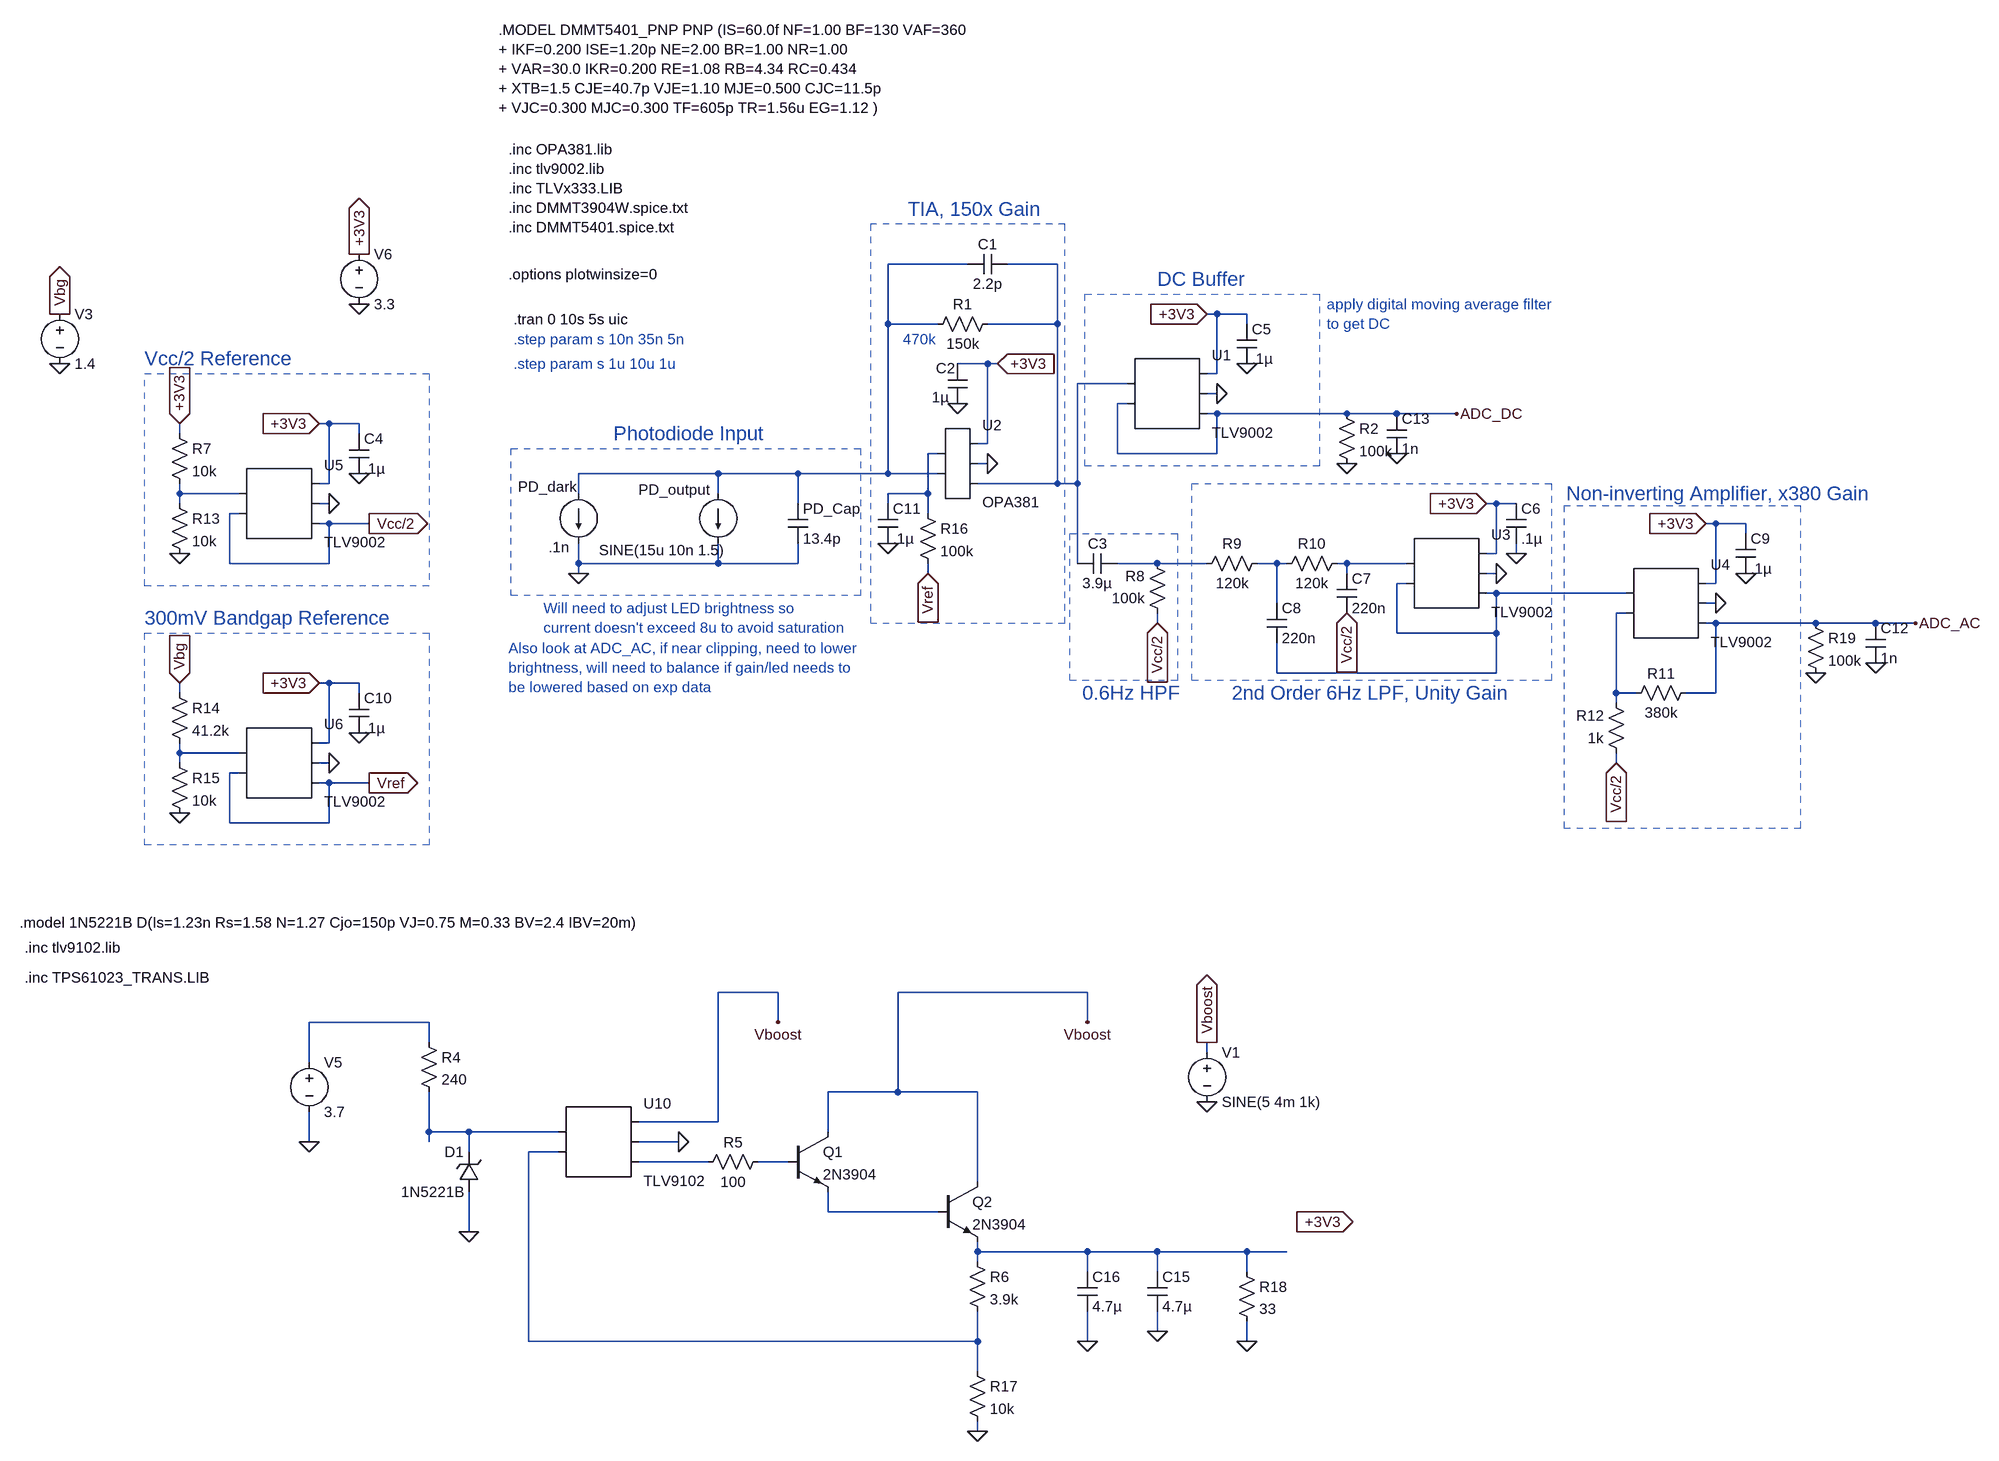
[diagram p0: schematic Capstone_AFE.asc]
Capstone_AFE.asc, the LTspice schematic file:
Version 4
SHEET 1 2868 2336
WIRE 1200 -160 1072 -160
WIRE 1344 -160 1264 -160
WIRE 1600 -80 1584 -80
WIRE 1648 -80 1600 -80
WIRE 1072 -64 1072 -160
WIRE 1152 -64 1072 -64
WIRE 1344 -64 1344 -160
WIRE 1344 -64 1232 -64
WIRE 1648 -64 1648 -80
WIRE 1232 0 1184 0
WIRE 1248 0 1232 0
WIRE 1600 16 1600 -80
WIRE 1600 16 1584 16
WIRE 1456 32 1376 32
WIRE 1600 48 1584 48
WIRE 1456 64 1440 64
WIRE 1600 80 1584 80
WIRE 1808 80 1600 80
WIRE 1888 80 1808 80
WIRE 1984 80 1888 80
WIRE 176 96 160 96
WIRE 224 96 176 96
WIRE -64 112 -64 96
WIRE 224 112 224 96
WIRE 1232 128 1232 0
WIRE 1232 128 1216 128
WIRE 1152 144 1136 144
WIRE 1440 144 1440 64
WIRE 1600 144 1600 80
WIRE 1600 144 1440 144
WIRE 1232 160 1216 160
WIRE 800 176 576 176
WIRE 928 176 800 176
WIRE 1072 176 1072 -64
WIRE 1072 176 928 176
WIRE 1152 176 1072 176
WIRE 176 192 176 96
WIRE 176 192 160 192
WIRE 1344 192 1344 -64
WIRE 1344 192 1216 192
WIRE 1376 192 1376 32
WIRE 1376 192 1344 192
WIRE -64 208 -64 192
WIRE 32 208 -64 208
WIRE 576 208 576 176
WIRE 800 208 800 176
WIRE 1136 208 1136 144
WIRE 1136 208 1072 208
WIRE -64 224 -64 208
WIRE 176 224 160 224
WIRE 928 224 928 176
WIRE 1072 224 1072 208
WIRE 2048 224 2032 224
WIRE 2080 224 2048 224
WIRE 32 240 16 240
WIRE 1136 240 1136 208
WIRE 176 256 160 256
WIRE 240 256 176 256
WIRE 2400 256 2384 256
WIRE 2448 256 2400 256
WIRE 2448 272 2448 256
WIRE 2048 304 2048 224
WIRE 2048 304 2032 304
WIRE 2080 304 2080 288
WIRE 16 320 16 240
WIRE 176 320 176 256
WIRE 176 320 16 320
WIRE 576 320 576 288
WIRE 800 320 800 288
WIRE 800 320 576 320
WIRE 928 320 928 288
WIRE 928 320 800 320
WIRE 1376 320 1376 192
WIRE 1504 320 1440 320
WIRE 1584 320 1504 320
WIRE 1696 320 1664 320
WIRE 1712 320 1696 320
WIRE 1808 320 1792 320
WIRE 1904 320 1808 320
WIRE 576 336 576 320
WIRE 1136 336 1136 320
WIRE 1808 336 1808 320
WIRE 2048 336 2032 336
WIRE 1904 352 1888 352
WIRE 2400 352 2400 256
WIRE 2400 352 2384 352
WIRE 2048 368 2032 368
WIRE 2256 368 2048 368
WIRE 1696 384 1696 320
WIRE 2400 384 2384 384
WIRE 2256 400 2240 400
WIRE 1504 416 1504 400
WIRE 2400 416 2384 416
WIRE 2560 416 2400 416
WIRE 2656 416 2560 416
WIRE 2720 416 2656 416
WIRE 1888 432 1888 352
WIRE 2048 432 2048 368
WIRE 2048 432 1888 432
WIRE 1696 496 1696 448
WIRE 2048 496 2048 432
WIRE 2048 496 1696 496
WIRE 176 512 160 512
WIRE 224 512 176 512
WIRE -64 528 -64 512
WIRE 224 528 224 512
WIRE 2240 528 2240 400
WIRE 2272 528 2240 528
WIRE 2400 528 2400 416
WIRE 2400 528 2352 528
WIRE 2240 544 2240 528
WIRE 176 608 176 512
WIRE 176 608 160 608
WIRE -64 624 -64 608
WIRE 32 624 -64 624
WIRE -64 640 -64 624
WIRE 176 640 160 640
WIRE 2240 640 2240 624
WIRE 32 656 16 656
WIRE 176 672 160 672
WIRE 240 672 176 672
WIRE 16 736 16 656
WIRE 176 736 176 672
WIRE 176 736 16 736
WIRE 896 1008 800 1008
WIRE 1392 1008 1088 1008
WIRE 336 1056 144 1056
WIRE 896 1056 896 1008
WIRE 1392 1056 1392 1008
WIRE 336 1088 336 1056
WIRE 1584 1104 1584 1088
WIRE 144 1120 144 1056
WIRE 1088 1168 1088 1008
WIRE 1088 1168 976 1168
WIRE 1216 1168 1088 1168
WIRE 800 1216 800 1008
WIRE 800 1216 672 1216
WIRE 336 1232 336 1168
WIRE 400 1232 336 1232
WIRE 544 1232 400 1232
WIRE 976 1232 976 1168
WIRE 144 1248 144 1200
WIRE 336 1248 336 1232
WIRE 736 1248 672 1248
WIRE 400 1264 400 1232
WIRE 544 1264 496 1264
WIRE 784 1280 672 1280
WIRE 912 1280 864 1280
WIRE 1216 1312 1216 1168
WIRE 976 1360 976 1328
WIRE 1152 1360 976 1360
WIRE 400 1392 400 1328
WIRE 1216 1424 1216 1408
WIRE 1392 1424 1216 1424
WIRE 1504 1424 1392 1424
WIRE 1648 1424 1504 1424
WIRE 1712 1424 1648 1424
WIRE 1216 1440 1216 1424
WIRE 1392 1456 1392 1424
WIRE 1504 1456 1504 1424
WIRE 1648 1456 1648 1424
WIRE 1504 1552 1504 1520
WIRE 496 1568 496 1264
WIRE 1216 1568 1216 1520
WIRE 1216 1568 496 1568
WIRE 1392 1568 1392 1520
WIRE 1648 1568 1648 1536
WIRE 1216 1616 1216 1568
WIRE 1216 1712 1216 1696
FLAG -64 512 Vbg
IOPIN -64 512 In
FLAG 576 336 0
FLAG 1136 336 Vref
IOPIN 1136 336 In
FLAG 1184 64 0
FLAG 1248 0 +3V3
IOPIN 1248 0 In
FLAG 1232 160 0
FLAG 1504 416 Vcc/2
IOPIN 1504 416 In
FLAG 1648 0 0
FLAG 1584 -80 +3V3
IOPIN 1584 -80 In
FLAG 1600 48 0
FLAG 240 256 Vcc/2
IOPIN 240 256 Out
FLAG 1984 80 ADC_DC
FLAG 2080 304 0
FLAG 2032 224 +3V3
IOPIN 2032 224 In
FLAG 2048 336 0
FLAG 1808 400 Vcc/2
IOPIN 1808 400 In
FLAG 2448 336 0
FLAG 2384 256 +3V3
IOPIN 2384 256 In
FLAG 2400 384 0
FLAG 2240 640 Vcc/2
IOPIN 2240 640 In
FLAG 2720 416 ADC_AC
FLAG 224 176 0
FLAG 160 96 +3V3
IOPIN 160 96 In
FLAG 176 224 0
FLAG -64 96 +3V3
IOPIN -64 96 In
FLAG -64 304 0
FLAG 224 592 0
FLAG 160 512 +3V3
IOPIN 160 512 In
FLAG 176 640 0
FLAG -64 720 0
FLAG 240 672 Vref
IOPIN 240 672 Out
FLAG 224 -96 0
FLAG 224 -176 +3V3
IOPIN 224 -176 Out
FLAG 1072 288 0
FLAG -256 0 0
FLAG -256 -80 Vbg
IOPIN -256 -80 Out
FLAG 736 1248 0
FLAG 144 1248 0
FLAG 1216 1712 0
FLAG 1504 1552 0
FLAG 1648 1568 0
FLAG 896 1056 Vboost
FLAG 1392 1056 Vboost
FLAG 400 1392 0
FLAG 1392 1568 0
FLAG 1728 1376 +3V3
IOPIN 1728 1376 Out
FLAG 1584 1184 0
FLAG 1584 1088 Vboost
IOPIN 1584 1088 Out
FLAG 2560 496 0
FLAG 2656 480 0
FLAG 1888 144 0
FLAG 1808 160 0
SYMBOL current 800 208 R0
WINDOW 0 -128 -6 Left 2
WINDOW 3 -191 91 Left 2
SYMATTR InstName PD_output
SYMATTR Value SINE(15u 10n 1.5)
SYMBOL current 576 208 R0
WINDOW 0 -97 -11 Left 2
WINDOW 3 -48 86 Left 2
SYMATTR InstName PD_dark
SYMATTR Value .1n
SYMBOL Cap 912 224 R0
SYMATTR InstName PD_Cap
SYMATTR Value 13.4p
SYMBOL Res 1248 -80 R90
WINDOW 0 0 56 VBottom 2
WINDOW 3 32 56 VTop 2
SYMATTR InstName R1
SYMATTR Value 150k
SYMBOL Cap 1264 -176 R90
WINDOW 0 0 32 VBottom 2
WINDOW 3 32 32 VTop 2
SYMATTR InstName C1
SYMATTR Value 2.2p
SYMBOL Cap 1168 0 R0
WINDOW 0 -19 7 Left 2
WINDOW 3 -25 53 Left 2
SYMATTR InstName C2
SYMATTR Value 1µ
SYMBOL AutoGenerated/OPA381 1184 160 R0
SYMATTR InstName U2
SYMBOL Res 1520 416 R180
WINDOW 0 36 76 Left 2
WINDOW 3 36 40 Left 2
SYMATTR InstName R8
SYMATTR Value 100k
SYMBOL Cap 1440 304 R90
WINDOW 0 0 32 VBottom 2
WINDOW 3 32 32 VTop 2
SYMATTR InstName C3
SYMATTR Value 3.9µ
SYMBOL Cap 1632 -64 R0
SYMATTR InstName C5
SYMATTR Value .1µ
SYMBOL AutoGenerated/TLV9002 1520 48 R0
SYMATTR InstName U1
SYMBOL AutoGenerated/TLV9002 1968 336 R0
SYMATTR InstName U3
SYMBOL Cap 2064 224 R0
SYMATTR InstName C6
SYMATTR Value .1µ
SYMBOL Res 1680 304 R90
WINDOW 0 0 56 VBottom 2
WINDOW 3 32 56 VTop 2
SYMATTR InstName R9
SYMATTR Value 120k
SYMBOL Res 1808 304 R90
WINDOW 0 0 56 VBottom 2
WINDOW 3 32 56 VTop 2
SYMATTR InstName R10
SYMATTR Value 120k
SYMBOL Cap 1792 336 R0
SYMATTR InstName C7
SYMATTR Value 220n
SYMBOL Cap 1680 384 R0
SYMATTR InstName C8
SYMATTR Value 220n
SYMBOL Cap 2432 272 R0
SYMATTR InstName C9
SYMATTR Value .1µ
SYMBOL AutoGenerated/TLV9002 2320 384 R0
SYMATTR InstName U4
SYMBOL Res 2368 512 R90
WINDOW 0 0 56 VBottom 2
WINDOW 3 32 56 VTop 2
SYMATTR InstName R11
SYMATTR Value 380k
SYMBOL Res 2256 640 R180
WINDOW 0 36 76 Left 2
WINDOW 3 36 40 Left 2
SYMATTR InstName R12
SYMATTR Value 1k
SYMBOL Cap 208 112 R0
SYMATTR InstName C4
SYMATTR Value .1µ
SYMBOL AutoGenerated/TLV9002 96 224 R0
SYMATTR InstName U5
SYMBOL Res -80 96 R0
SYMATTR InstName R7
SYMATTR Value 10k
SYMBOL Res -80 208 R0
SYMATTR InstName R13
SYMATTR Value 10k
SYMBOL Cap 208 528 R0
SYMATTR InstName C10
SYMATTR Value .1µ
SYMBOL AutoGenerated/TLV9002 96 640 R0
SYMATTR InstName U6
SYMBOL Res -80 512 R0
SYMATTR InstName R14
SYMATTR Value 41.2k
SYMBOL Res -80 624 R0
SYMATTR InstName R15
SYMATTR Value 10k
SYMBOL Cap 1056 224 R0
SYMATTR InstName C11
SYMATTR Value .1µ
SYMBOL Res 1120 224 R0
SYMATTR InstName R16
SYMATTR Value 100k
SYMBOL Voltage -256 -96 R0
SYMATTR InstName V3
SYMATTR Value 1.4
SYMBOL res 320 1072 R0
SYMATTR InstName R4
SYMATTR Value 240
SYMBOL voltage 144 1104 R0
WINDOW 123 0 0 Left 0
WINDOW 39 0 0 Left 0
SYMATTR InstName V5
SYMATTR Value 3.7
SYMBOL res 880 1264 R90
WINDOW 0 0 56 VBottom 2
WINDOW 3 32 56 VTop 2
SYMATTR InstName R5
SYMATTR Value 100
SYMBOL npn 912 1232 R0
SYMATTR InstName Q1
SYMATTR Value 2N3904
SYMBOL npn 1152 1312 R0
SYMATTR InstName Q2
SYMATTR Value 2N3904
SYMBOL res 1200 1424 R0
SYMATTR InstName R6
SYMATTR Value 3.9k
SYMBOL res 1200 1600 R0
SYMATTR InstName R17
SYMATTR Value 10k
SYMBOL cap 1488 1456 R0
SYMATTR InstName C15
SYMATTR Value 4.7µ
SYMBOL res 1632 1440 R0
SYMATTR InstName R18
SYMATTR Value 33
SYMBOL zener 416 1328 R180
WINDOW 0 24 64 Left 2
WINDOW 3 24 0 Left 2
SYMATTR InstName D1
SYMATTR Value 1N5221B
SYMBOL cap 1376 1456 R0
SYMATTR InstName C16
SYMATTR Value 4.7µ
SYMBOL AutoGenerated/TLV9102 608 1248 R0
SYMATTR InstName U10
SYMBOL Voltage 1584 1088 R0
SYMATTR InstName V1
SYMATTR Value SINE(5 4m 1k)
SYMBOL Voltage 224 -192 R0
SYMATTR InstName V6
SYMATTR Value 3.3
SYMBOL Res 2544 400 R0
SYMATTR InstName R19
SYMATTR Value 100k
SYMBOL Cap 2640 416 R0
SYMATTR InstName C12
SYMATTR Value 1n
SYMBOL Res 1792 64 R0
SYMATTR InstName R2
SYMATTR Value 100k
SYMBOL Cap 1872 80 R0
SYMATTR InstName C13
SYMATTR Value 1n
TEXT 464 -344 Left 2 !.inc OPA381.lib\n.inc tlv9002.lib\n.inc TLVx333.LIB\n.inc DMMT3904W.spice.txt\n.inc DMMT5401.spice.txt
TEXT 472 -72 Left 2 !.tran 0 10s 5s uic
TEXT 464 -144 Left 2 !.options plotwinsize=0
TEXT 520 392 Left 2 ;Will need to adjust LED brightness so \ncurrent doesn't exceed 8u to avoid saturation
TEXT 1776 -96 Left 2 ;apply digital moving average filter \nto get DC
TEXT 1384 528 Left 3 ;0.6Hz HPF
TEXT 1624 528 Left 3 ;2nd Order 6Hz LPF, Unity Gain
TEXT 2160 208 Left 3 ;Non-inverting Amplifier, x380 Gain
TEXT 1104 -248 Left 3 ;TIA, 150x Gain
TEXT 1504 -136 Left 3 ;DC Buffer
TEXT 632 112 Left 3 ;Photodiode Input
TEXT 472 -40 Left 2 ;.step param s 10n 35n 5n
TEXT 464 456 Left 2 ;Also look at ADC_AC, if near clipping, need to lower \nbrightness, will need to balance if gain/led needs to \nbe lowered based on exp data
TEXT 472 0 Left 2 ;.step param s 1u 10u 1u
TEXT -120 -8 Left 3 ;Vcc/2 Reference
TEXT -120 408 Left 3 ;300mV Bandgap Reference
TEXT 1096 -40 Left 2 ;470k
TEXT 448 -536 Left 2 !.MODEL DMMT5401_PNP PNP (IS=60.0f NF=1.00 BF=130 VAF=360 \n+ IKF=0.200 ISE=1.20p NE=2.00 BR=1.00 NR=1.00 \n+ VAR=30.0 IKR=0.200 RE=1.08 RB=4.34 RC=0.434 \n+ XTB=1.5 CJE=40.7p VJE=1.10 MJE=0.500 CJC=11.5p \n+ VJC=0.300 MJC=0.300 TF=605p TR=1.56u EG=1.12 )
TEXT -312 984 Left 2 !.inc TPS61023_TRANS.LIB
TEXT -312 936 Left 2 !.inc tlv9102.lib
TEXT -320 896 Left 2 !.model 1N5221B D(Is=1.23n Rs=1.58 N=1.27 Cjo=150p VJ=0.75 M=0.33 BV=2.4 IBV=20m)
RECTANGLE Normal 1388 -112 1764 164 2
RECTANGLE Normal 1560 192 2136 508 2
RECTANGLE Normal 2536 228 2156 744 2
RECTANGLE Normal 1364 272 1536 508 2
RECTANGLE Normal 468 136 1028 372 2
RECTANGLE Normal -120 16 336 356 2
RECTANGLE Normal -120 432 336 772 2
RECTANGLE Normal 1044 416 1356 -224 2

The netlist it stands for:
* Capstone_AFE.asc
I§PD_output N001 0 SINE(15u 10n 1.5)
I§PD_dark N001 0 .1n
C§PD_Cap N001 0 13.4p
R1 N002 N001 150k
C1 N002 N001 2.2p
C2 +3V3 0 1µ
* U2: OPA381 (symbol AutoGenerated/OPA381 not available, pins judged from their places): pin1=N003 pin2=N001 pin3=+3V3 pin4=0 pin5=N002
R8 Vcc/2 N005 100k
C3 N005 N002 3.9µ
C5 +3V3 0 .1µ
* U1: TLV9002 (symbol AutoGenerated/TLV9002 not available, pins judged from their places): pin1=N002 pin2=ADC_DC pin3=+3V3 pin4=0 pin5=ADC_DC
* U3: TLV9002 (symbol AutoGenerated/TLV9002 not available, pins judged from their places): pin1=N007 pin2=N008 pin3=+3V3 pin4=0 pin5=N008
C6 +3V3 0 .1µ
R9 N006 N005 120k
R10 N007 N006 120k
C7 N007 Vcc/2 220n
C8 N006 N008 220n
C9 +3V3 0 .1µ
* U4: TLV9002 (symbol AutoGenerated/TLV9002 not available, pins judged from their places): pin1=N008 pin2=N009 pin3=+3V3 pin4=0 pin5=ADC_AC
R11 ADC_AC N009 380k
R12 Vcc/2 N009 1k
C4 +3V3 0 .1µ
* U5: TLV9002 (symbol AutoGenerated/TLV9002 not available, pins judged from their places): pin1=N004 pin2=Vcc/2 pin3=+3V3 pin4=0 pin5=Vcc/2
R7 +3V3 N004 10k
R13 N004 0 10k
C10 +3V3 0 .1µ
* U6: TLV9002 (symbol AutoGenerated/TLV9002 not available, pins judged from their places): pin1=N010 pin2=Vref pin3=+3V3 pin4=0 pin5=Vref
R14 Vbg N010 41.2k
R15 N010 0 10k
C11 N003 0 .1µ
R16 N003 Vref 100k
V3 Vbg 0 1.4
R4 N011 N012 240
V5 N011 0 3.7
R5 N015 N014 100
Q1 Vboost N015 N016 0 2N3904
Q2 Vboost N016 N017 0 2N3904
R6 N017 N013 3.9k
R17 N013 0 10k
C15 N017 0 4.7µ
R18 N017 0 33
D1 0 N012 1N5221B
C16 N017 0 4.7µ
* U10: TLV9102 (symbol AutoGenerated/TLV9102 not available, pins judged from their places): pin1=N012 pin2=N013 pin3=Vboost pin4=0 pin5=N014
V1 Vboost 0 SINE(5 4m 1k)
V6 +3V3 0 3.3
R19 ADC_AC 0 100k
C12 ADC_AC 0 1n
R2 ADC_DC 0 100k
C13 ADC_DC 0 1n
.model D D
.lib standard.dio
.model NPN NPN
.model PNP PNP
.lib standard.bjt
.inc OPA381.lib
.inc tlv9002.lib
.inc TLVx333.LIB
.inc DMMT3904W.spice.txt
.inc DMMT5401.spice.txt
.tran 0 10s 5s uic
.options plotwinsize=0
* Will need to adjust LED brightness so
* current doesn't exceed 8u to avoid saturation
* apply digital moving average filter
* to get DC
* 0.6Hz HPF
* 2nd Order 6Hz LPF, Unity Gain
* Non-inverting Amplifier, x380 Gain
* TIA, 150x Gain
* DC Buffer
* Photodiode Input
* .step param s 10n 35n 5n
* Also look at ADC_AC, if near clipping, need to lower
* brightness, will need to balance if gain/led needs to
* be lowered based on exp data
* .step param s 1u 10u 1u
* Vcc/2 Reference
* 300mV Bandgap Reference
* 470k
.MODEL DMMT5401_PNP PNP (IS=60.0f NF=1.00 BF=130 VAF=360
+ IKF=0.200 ISE=1.20p NE=2.00 BR=1.00 NR=1.00
+ VAR=30.0 IKR=0.200 RE=1.08 RB=4.34 RC=0.434
+ XTB=1.5 CJE=40.7p VJE=1.10 MJE=0.500 CJC=11.5p
+ VJC=0.300 MJC=0.300 TF=605p TR=1.56u EG=1.12 )
.inc TPS61023_TRANS.LIB
.inc tlv9102.lib
.model 1N5221B D(Is=1.23n Rs=1.58 N=1.27 Cjo=150p VJ=0.75 M=0.33 BV=2.4 IBV=20m)
.backanno
.end